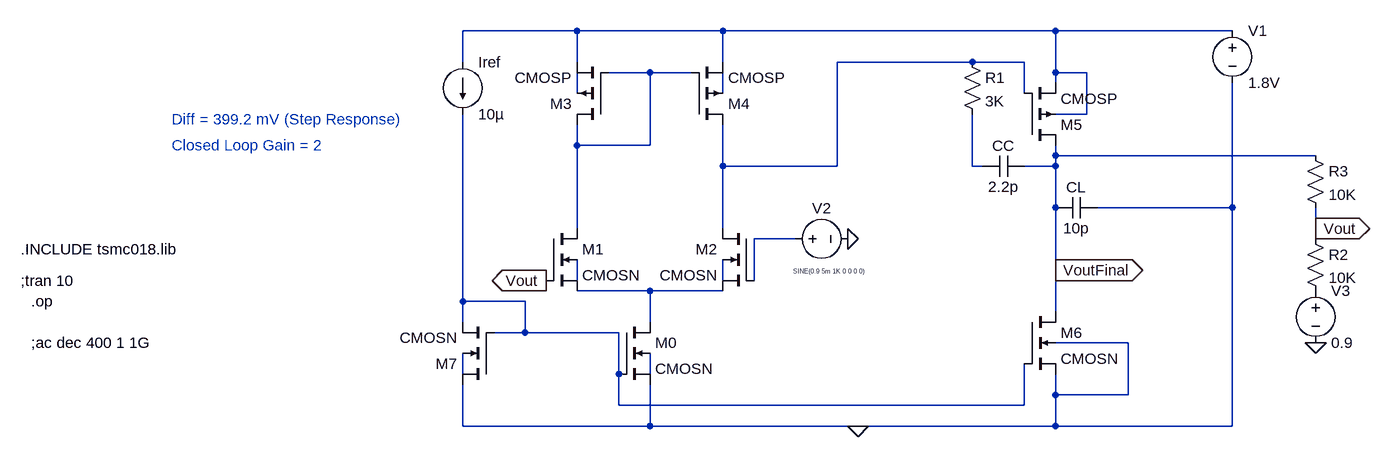
[diagram p0: schematic OTAassignment.asc]
OTAassignment.asc, the LTspice schematic file:
Version 4
SHEET 1 2420 832
WIRE 336 32 160 32
WIRE 560 32 336 32
WIRE 1072 32 560 32
WIRE 1344 32 1072 32
WIRE 160 80 160 32
WIRE 336 80 336 32
WIRE 560 80 560 32
WIRE 944 80 736 80
WIRE 1024 80 944 80
WIRE 448 96 384 96
WIRE 512 96 448 96
WIRE 1072 96 1072 32
WIRE 1120 96 1072 96
WIRE 1072 112 1072 96
WIRE 336 128 336 96
WIRE 560 128 560 96
WIRE 1024 128 1024 80
WIRE 1120 160 1120 96
WIRE 1120 160 1072 160
WIRE 336 208 336 176
WIRE 448 208 448 96
WIRE 448 208 336 208
WIRE 1072 224 1072 208
WIRE 1472 224 1072 224
WIRE 560 240 560 176
WIRE 736 240 736 80
WIRE 736 240 560 240
WIRE 944 240 944 160
WIRE 960 240 944 240
WIRE 1072 240 1072 224
WIRE 1072 240 1024 240
WIRE 1072 304 1072 240
WIRE 1344 304 1344 112
WIRE 1344 304 1136 304
WIRE 336 336 336 208
WIRE 560 336 560 240
WIRE 1472 336 1472 304
WIRE 672 352 608 352
WIRE 1472 352 1472 336
WIRE 1072 400 1072 304
WIRE 336 416 336 384
WIRE 560 416 560 384
WIRE 608 416 608 352
WIRE 448 432 336 432
WIRE 560 432 448 432
WIRE 160 448 160 160
WIRE 256 448 160 448
WIRE 1072 464 1072 400
WIRE 160 480 160 448
WIRE 448 480 448 432
WIRE 256 496 256 448
WIRE 256 496 208 496
WIRE 400 496 256 496
WIRE 1184 512 1072 512
WIRE 160 560 160 528
WIRE 400 560 400 496
WIRE 448 560 448 528
WIRE 448 560 432 560
WIRE 1072 592 1072 560
WIRE 1184 592 1184 512
WIRE 1184 592 1072 592
WIRE 400 608 400 560
WIRE 1024 608 1024 544
WIRE 1024 608 400 608
WIRE 160 640 160 576
WIRE 448 640 448 576
WIRE 448 640 160 640
WIRE 768 640 448 640
WIRE 1072 640 1072 592
WIRE 1072 640 768 640
WIRE 1344 640 1344 304
WIRE 1344 640 1072 640
FLAG 768 640 0
FLAG 1472 512 0
FLAG 1472 336 Vout
IOPIN 1472 336 Out
FLAG 288 416 Vout
IOPIN 288 416 Out
FLAG 1072 400 VoutFinal
IOPIN 1072 400 Out
FLAG 752 352 0
SYMBOL cmosn 400 480 R0
SYMATTR InstName M0
SYMATTR Value2 l=0.9u w=19.6u
SYMBOL cmosn 208 576 R180
SYMATTR InstName M7
SYMATTR Value2 l=0.9u w=1.96u
SYMBOL cmosn 608 336 M0
SYMATTR InstName M2
SYMATTR Value2 l=0.9u w=9.8u
SYMBOL cmosn 288 336 R0
SYMATTR InstName M1
SYMATTR Value2 l=0.9u w=9.8u
SYMBOL cmosp 512 176 M180
SYMATTR InstName M4
SYMATTR Value2 l=0.9u w=22.5u
SYMBOL cmosp 384 176 R180
SYMATTR InstName M3
SYMATTR Value2 l=0.9u w=22.5u
SYMBOL current 160 80 R0
SYMATTR InstName Iref
SYMATTR Value 10µ
SYMBOL voltage 656 352 R270
WINDOW 0 32 56 VTop 2
WINDOW 3 -43 67 VBottom 0
SYMATTR InstName V2
SYMATTR Value SINE(0.9 5m 1K 0 0 0 0)
SYMATTR Value2 AC 1 180
SYMBOL voltage 1472 416 R0
SYMATTR InstName V3
SYMATTR Value 0.9
SYMATTR Value2 AC 0 180
SYMBOL cmosp 1024 208 M180
SYMATTR InstName M5
SYMATTR Value2 l=0.9u w=53u
SYMBOL cmosn 1024 464 R0
SYMATTR InstName M6
SYMATTR Value2 l=0.9u w=19.6u
SYMBOL voltage 1344 16 R0
SYMATTR InstName V1
SYMATTR Value 1.8V
SYMBOL cap 1024 224 R90
WINDOW 0 0 32 VBottom 2
WINDOW 3 32 32 VTop 2
SYMATTR InstName CC
SYMATTR Value 2.2p
SYMBOL Res 928 64 R0
SYMATTR InstName R1
SYMATTR Value 3K
SYMBOL res 1456 336 R0
SYMATTR InstName R2
SYMATTR Value 10K
SYMBOL res 1456 208 R0
SYMATTR InstName R3
SYMATTR Value 10K
SYMBOL cap 1136 288 R90
WINDOW 0 0 32 VBottom 2
WINDOW 3 32 32 VTop 2
SYMATTR InstName CL
SYMATTR Value 10p
TEXT -520 416 Left 2 !;tran 10
TEXT -520 368 Left 2 !.INCLUDE tsmc018.lib
TEXT -504 448 Left 2 !.op
TEXT -504 512 Left 2 !;ac dec 400 1 1G
TEXT -288 168 Left 2 ;Diff = 399.2 mV (Step Response)
TEXT -288 208 Left 2 ;Closed Loop Gain = 2

The netlist it stands for:
* OTAassignment.asc
M0 N010 N011 0 N013 CMOSN l=0.9u w=19.6u
M7 0 N011 N011 N012 CMOSN l=0.9u w=1.96u
M2 N002 N007 N010 N009 CMOSN l=0.9u w=9.8u
M1 N003 Vout N010 N008 CMOSN l=0.9u w=9.8u
M4 N002 N003 N001 N005 CMOSP l=0.9u w=22.5u
M3 N003 N003 N001 N004 CMOSP l=0.9u w=22.5u
Iref N001 N011 10µ
V2 N007 0 SINE(0.9 5m 1K 0 0 0 0) AC 1 180
V3 P001 0 0.9 AC 0 180
M5 VoutFinal N002 N001 N001 CMOSP l=0.9u w=53u
M6 VoutFinal N011 0 0 CMOSN l=0.9u w=19.6u
V1 N001 0 1.8V
CC VoutFinal N006 2.2p
R1 N002 N006 3K
R2 Vout P001 10K
R3 VoutFinal Vout 10K
CL 0 VoutFinal 10p
.model NMOS NMOS
.model PMOS PMOS
.lib standard.mos
;tran 10
.INCLUDE tsmc018.lib
.op
;ac dec 400 1 1G
* Diff = 399.2 mV (Step Response)
* Closed Loop Gain = 2
.backanno
.end